# EAGLE design MULTIWII (EAGLE 6.6.0)

## Sheet 1 of 2
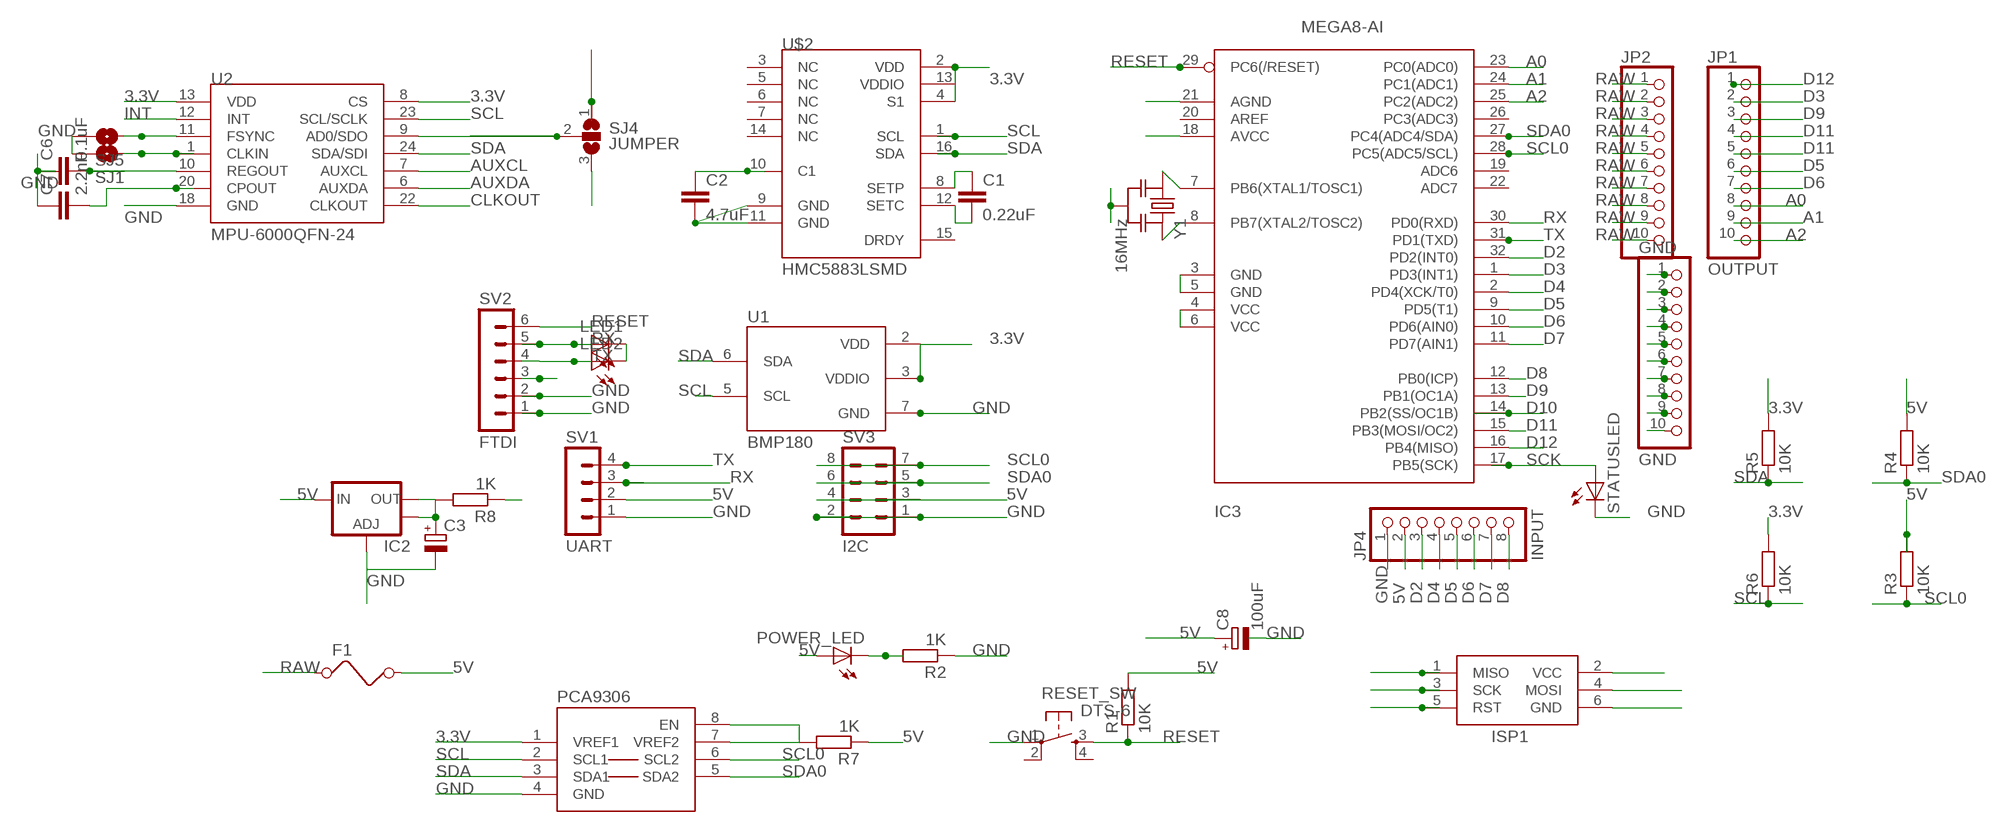
[diagram p0: schematic, sheet 1]

### Parts
C1  0.22uF  C-EUC0805  [C0805]
C2  4.7uF  C-EUC0805  [C0805]
C3  CPOL-EUA/3216-18R  [A/3216-18R]
C6  0.1uF  C-EUC0805  [C0805]
C7  2.2nF  C-EUC0805  [C0805]
C8  100uF  CPOL-EUCT7343  [CT7343]
F1  FUSEF  [1812]
GND  GND  PINHD-1X10  [1X10]
IC2  V_REG_LM1117SOT223  [SOT223]
IC3  MEGA8-AI  [TQFP32-08]
ISP1  AVRISP-6  [AVRISP]
JP1  OUTPUT  PINHD-1X10  [1X10]
JP2  PINHD-1X10  [1X10]
JP4  INPUT  PINHD-1X8  [1X08]
LED1  LEDCHIPLED_0805  [CHIPLED_0805]
LED2  LEDCHIPLED_0805  [CHIPLED_0805]
PCA9306  PCA9306  [PSOP-8]
POWER_LED  LEDCHIPLED_1206  [CHIPLED_1206]
R1  10K  R-EU_M0805  [M0805]
R2  1K  R-EU_M0805  [M0805]
R3  10K  R-EU_M0805  [M0805]
R4  10K  R-EU_M0805  [M0805]
R5  10K  R-EU_M0805  [M0805]
R6  10K  R-EU_M0805  [M0805]
R7  1K  R-EU_M0805  [M0805]
R8  1K  R-EU_M0805  [M0805]
RESET_SW  DTS-6  [DTS-6]
SJ1  SOLDERJUMPERNC  [SJ_2S]
SJ4  JUMPER  SJ2W  [SJ_2]
SJ5  SOLDERJUMPERNC  [SJ_2S]
STATUSLED  LEDCHIP-LED0805  [CHIP-LED0805]
SV1  UART  MA04-1  [MA04-1]
SV2  FTDI  MA06-1  [MA06-1]
SV3  I2C  MA04-2  [MA04-2]
U1  BMP180  [BMP180]
U2  MPU-6000QFN-24  [QFN-24-TESTING]
U$2  HMC5883LSMD  [16LPCC]
Y1  16MHz  RESONATOR-MURATACSTCR_G  [RESONATOR_MURATA3]

### Nets
3.3V: PCA9306.1(VREF1) R5.2 R6.2 R8.1 SJ4.1 U1.2(VDD) U1.3(VDDIO) U2.8(CS) U2.13(VDD) U$2.2(VDD) U$2.4(S1) U$2.13(VDDIO)
5V: C8.+ F1.2 IC2.3(IN) IC3.4(VCC) IC3.6(VCC) IC3.18(AVCC) ISP1.2(VCC) JP4.2 POWER_LED.A R1.2 R3.2 R4.2 R7.1 SV1.2 SV3.3 SV3.4
A0: IC3.23(PC0(ADC0)) JP1.8
A1: IC3.24(PC1(ADC1)) JP1.9
A2: IC3.25(PC2(ADC2)) JP1.10
AD0: SJ4.2 U2.9(AD0/SDO)
AUXCL: U2.7(AUXCL)
AUXDA: U2.6(AUXDA)
C1: C2.1 U$2.10(C1)
CLKOUT: U2.22(CLKOUT)
D2: IC3.32(PD2(INT0)) JP4.3
D3: IC3.1(PD3(INT1)) JP1.2
D4: IC3.2(PD4(XCK/T0)) JP4.4
D5: IC3.9(PD5(T1)) JP1.6 JP4.5
D6: IC3.10(PD6(AIN0)) JP1.7 JP4.6
D7: IC3.11(PD7(AIN1)) JP4.7
D8: IC3.12(PB0(ICP)) JP4.8
D9: IC3.13(PB1(OC1A)) JP1.3
D10: IC3.14(PB2(SS/OC1B)) JP1.4
D11: IC3.15(PB3(MOSI/OC2)) ISP1.4(MOSI) JP1.5
D12: IC3.16(PB4(MISO)) ISP1.1(MISO) JP1.1
GND: C2.2 C3.- C6.1 C7.1 C8.- GND.1 GND.2 GND.3 GND.4 GND.5 GND.6 GND.7 GND.8 GND.9 GND.10 IC2.1(ADJ) IC3.3(GND) IC3.5(GND) IC3.21(AGND) ISP1.6(GND) JP4.1 LED1.C LED2.C PCA9306.4(GND) R2.1 RESET_SW.1 SJ1.2 SJ4.3 SJ5.2 STATUSLED.C SV1.1 SV2.1 SV2.2 SV3.1 SV3.2 U1.7(GND) U2.18(GND) U$2.9(GND) U$2.11(GND) Y1.2
INT: U2.12(INT)
N$1: C7.2 U2.20(CPOUT)
N$2: C3.+ IC2.2(OUT) IC2.4(OUT) R8.2
N$6: IC3.7(PB6(XTAL1/TOSC1)) Y1.1
N$7: C1.1 U$2.8(SETP)
N$8: C1.2 U$2.12(SETC)
N$9: PCA9306.7(VREF2) PCA9306.8(EN) R7.2
N$11: IC3.8(PB7(XTAL2/TOSC2)) Y1.3
N$13: POWER_LED.C R2.2
N$16: SJ5.1 U2.11(FSYNC)
N$17: SJ1.1 U2.1(CLKIN)
N$18: C6.2 U2.10(REGOUT)
RAW: F1.1 JP2.1 JP2.2 JP2.3 JP2.4 JP2.5 JP2.6 JP2.7 JP2.8 JP2.9 JP2.10 SV2.3
RESET: IC3.29(PC6(/RESET)) ISP1.5(RST) R1.1 RESET_SW.3 SV2.6
RX: IC3.30(PD0(RXD)) LED1.A SV1.3 SV2.5
SCK: IC3.17(PB5(SCK)) ISP1.3(SCK) STATUSLED.A
SCL: PCA9306.2(SCL1) R6.1 U1.5(SCL) U2.23(SCL/SCLK) U$2.1(SCL)
SCL0: IC3.28(PC5(ADC5/SCL)) PCA9306.6(SCL2) R3.1 SV3.7 SV3.8
SDA: PCA9306.3(SDA1) R5.1 U1.6(SDA) U2.24(SDA/SDI) U$2.16(SDA)
SDA0: IC3.27(PC4(ADC4/SDA)) PCA9306.5(SDA2) R4.1 SV3.5 SV3.6
TX: IC3.31(PD1(TXD)) LED2.A SV1.4 SV2.4
Unconnected: IC3.19(ADC6) IC3.20(AREF) IC3.22(ADC7) IC3.26(PC3(ADC3)) RESET_SW.2 RESET_SW.4 U$2.3(NC) U$2.5(NC) U$2.6(NC) U$2.7(NC) U$2.14(NC) U$2.15(DRDY)

## Sheet 2 of 2

## Library data of the parts
C1 C2 C6 C7 = rcl:C-EU: CAPACITOR, European symbol
C3 C8 = rcl:CPOL-EU: POLARIZED CAPACITOR, European symbol
F1 = m-pad-2.1:FUSE: Fuse's in various packages
GND JP1 JP2 = pinhead:PINHD-1X10: PIN HEADER
IC2 = SparkFun-PowerIC:V_REG_LM1117: Voltage Regulator LM1117 Standard adjustable voltage regulator but in SMD form. Spark Fun Electronics SKU : COM-00595
IC3 = avr-7:MEGA8: MICROCONTROLLER 8 Kbytes FLASH 1 kbytes SRAM 512 bytes EEPROM USART 6-channel 10 bit ADC 2-channel 8 bit ADC
ISP1 = adafruit:AVRISP: AVR ISP HEADER Standard 6 pin header for AVR programming
JP4 = pinhead:PINHD-1X8: PIN HEADER
LED1 LED2 POWER_LED STATUSLED = adafruit:LED: LED OSRAM: - CHIPLED LG R971, LG N971, LY N971, LG Q971, LY Q971, LO R971, LY R971 LH N974, LH R974 LS Q976, LO Q976, LY Q976 LO Q996 - Hyper CHIPLED LW Q18S LB Q993, LB Q99A, LB R99A - SideLED LS A670, LO A670, LY A670, LG A670, LP A670 LB A673, LV A673, LT A673, LW A673 LH A674 LY A675 LS A676, LA A676, LO A676, LY A676, LW A676 LS A679, LY A679, LG A679 - Hyper Micro SIDELED® LS Y876, LA Y876, LO Y876, LY Y876 LT Y87S - SmartLED LW L88C, LW L88S LB L89C, LB L89S, LG L890 LS L89K, LO L89K, LY L89K LS L896, LA L896, LO L896, LY L896 - TOPLED LS T670, LO T670, LY T670, LG T670, LP T670 LSG T670, LSP T670, LSY T670, LOP T670, LYG T670 LG T671, LOG T671, LSG T671 LB T673, LV T673, LT T673, LW T673 LH T674 LS T676, LA T676, LO T676, LY T676, LB T676, LH T676, LSB T676, LW T676 LB T67C, LV T67C, LT T67C, LS T67K, LO T67K, LY T67K, LW E67C LS E67B, LA E67B, LO E67B, LY E67B, LB E67C, LV E67C, LT E67C LW T67C LS T679, LY T679, LG T679 LS T770, LO T770, LY T770, LG T770, LP T770 LB T773, LV T773, LT T773, LW T773 LH T774 LS E675, LA E675, LY E675, LS T675 LS T776, LA T776, LO T776, LY T776, LB T776 LHGB T686 LT T68C, LB T68C - Hyper Mini TOPLED® LB M676 - Mini TOPLED Santana® LG M470 LS M47K, LO M47K, LY M47K Source: http://www.osram.convergy.de/
PCA9306 = SparkFun-DigitalIC:PCA9306: Bidirectional I2C level shifter. NOT compatible with all available part number pinout schemes- DOUBLE CHECK!!!; PROD_ID: IC-10023
R1-R8 = rcl:R-EU_: RESISTOR, European symbol
RESET_SW = switch-tact:DTS-6
SJ1 SJ5 = Eagle-JeeLabs:SOLDERJUMPER: Solder Jumper Standard SMD solder jumper. Used to automate production. Two varients : Normally Open and Normally Closed are the same, but have different paste layers. NC will have a large amount of paste and should jumper during reflow.
SJ4 = jumper:SJ2W: SMD solder JUMPER
SV1 = con-lstb:MA04-1: PIN HEADER; OC_FARNELL: unknown; OC_NEWARK: unknown
SV2 = con-lstb:MA06-1: PIN HEADER; OC_FARNELL: unknown; OC_NEWARK: unknown
SV3 = con-lstb:MA04-2: PIN HEADER; OC_FARNELL: unknown; OC_NEWARK: unknown
U1 = SparkFun-Sensors:BMP180: BOSCH BMP180 DIGITAL BAROMETRIC PRESSURE SENSOR Web page: http://www.bosch-sensortec.com/en/homepage/products_3/environmental_sensors_1/bmp180_1/bmp180 Datasheet: http://ae-bst.resource.bosch.com/media/products/dokumente/bmp180/BST-BMP180-DS000-09.pdf The BMP180 is the function compatible successor of the BMP085, a new generation of high precision digital pressure sensors for consumer applications. The ultra-low power, low voltage electronics of the BMP180 is optimized for use in mobile phones, PDAs, GPS navigation devices and outdoor equipment. With a low altitude noise of merely 0.25m at fast conversion time, the BMP180 offers superior performance. The I2C interface allows for easy system integration with a microcontroller. The BMP180 is based on piezo-resistive technology for EMC robustness, high accuracy and linearity as well as long term stability. Key features: - Temperature measurement included - I2C interface - Fully calibrated - Pb-free, halogen-free and RoHS compliant, - MSL 1 Basic specs: Pressure range: 300 to 1100hPa (+9000m to -500m relating to sea level) Supply voltage: 1.8 to 3.6V (VDD), 1.62V to 3.6V (VDDIO) Package: LGA package with metal lid Small footprint: 3.6mm x 3.8mm Super-flat: 0.93mm height Low power: 5μA at 1 sample / sec. in standard mode Low noise: 0.06hPa (0.5m) in ultra low power mode, 0.02hPa (0.17m) advanced resolution mode Typical applications: - Enhancement of GPS navigation (dead-reckoning, slope detection, etc.) - In- and out-door navigation - Leisure and sports - Weather forecast - Vertical velocity indication (rise/sink speed)
U2 = SparkFun-Sensors:MPU-6000: MPU-6000 - I2C address is 0x68 with AD0 low and 0x69 with AD0 high.
U$2 = SparkFun-Sensors:HMC5883L: 3 Axis Digital Compass IC
Y1 = m-pad-2.1:RESONATOR-MURATA: Murata ceramic Resonator "ceralock" CSTCE series with built in load capacitance +- 0.5% tolerance 12.51MHz to 19.99MHz 16MHz murata part#: CSTCE16M0V53-R0 16MHz digikey part#: 490-1198-1-ND $1.33 each

## Board
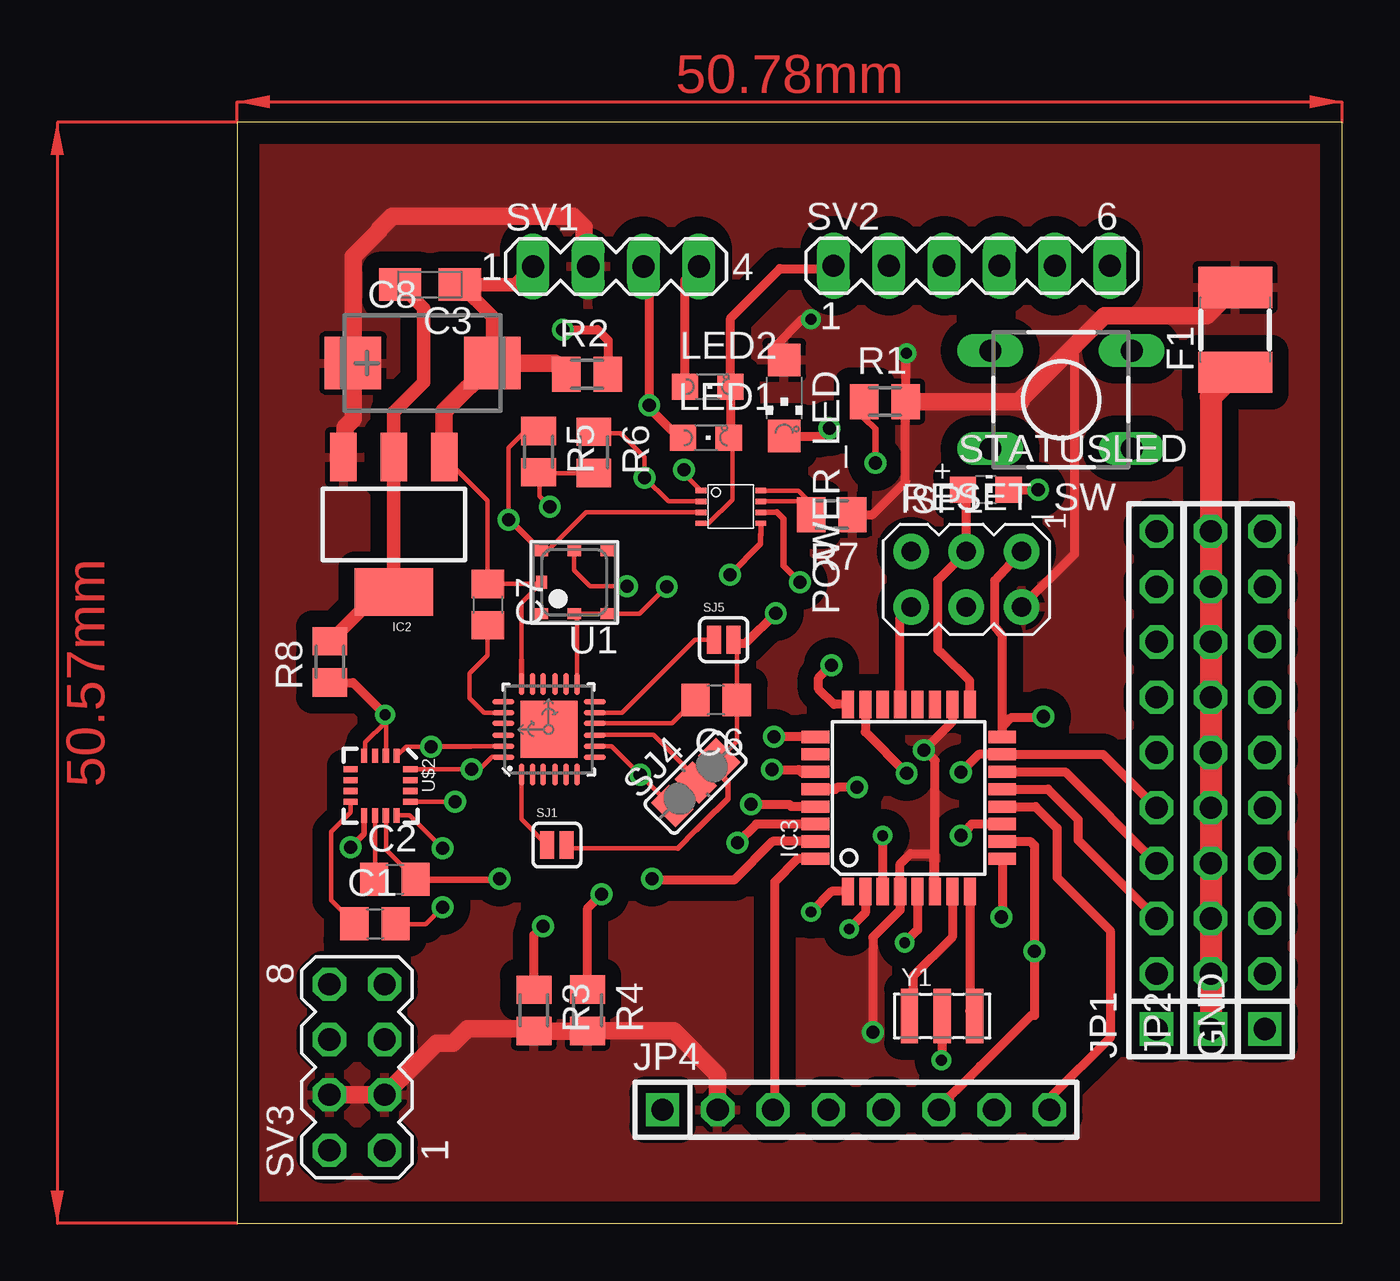
[diagram p1: board, top side]
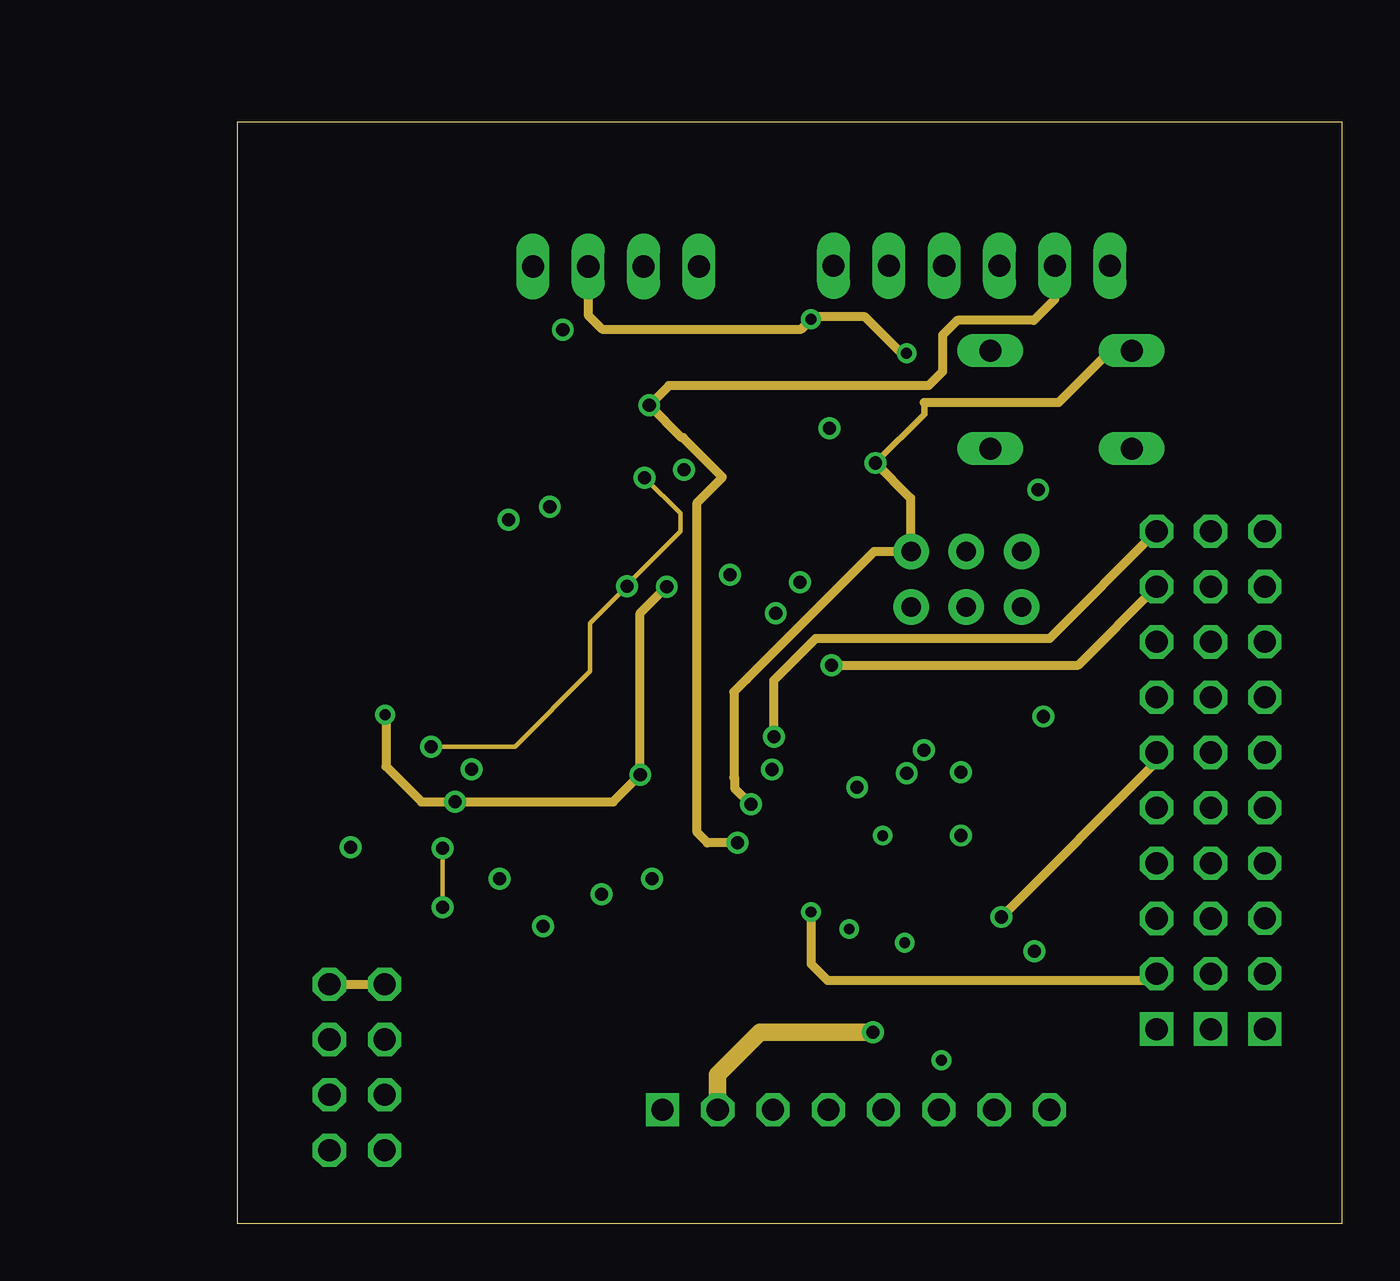
[diagram p2: board, inner layer 2NDLAYER]
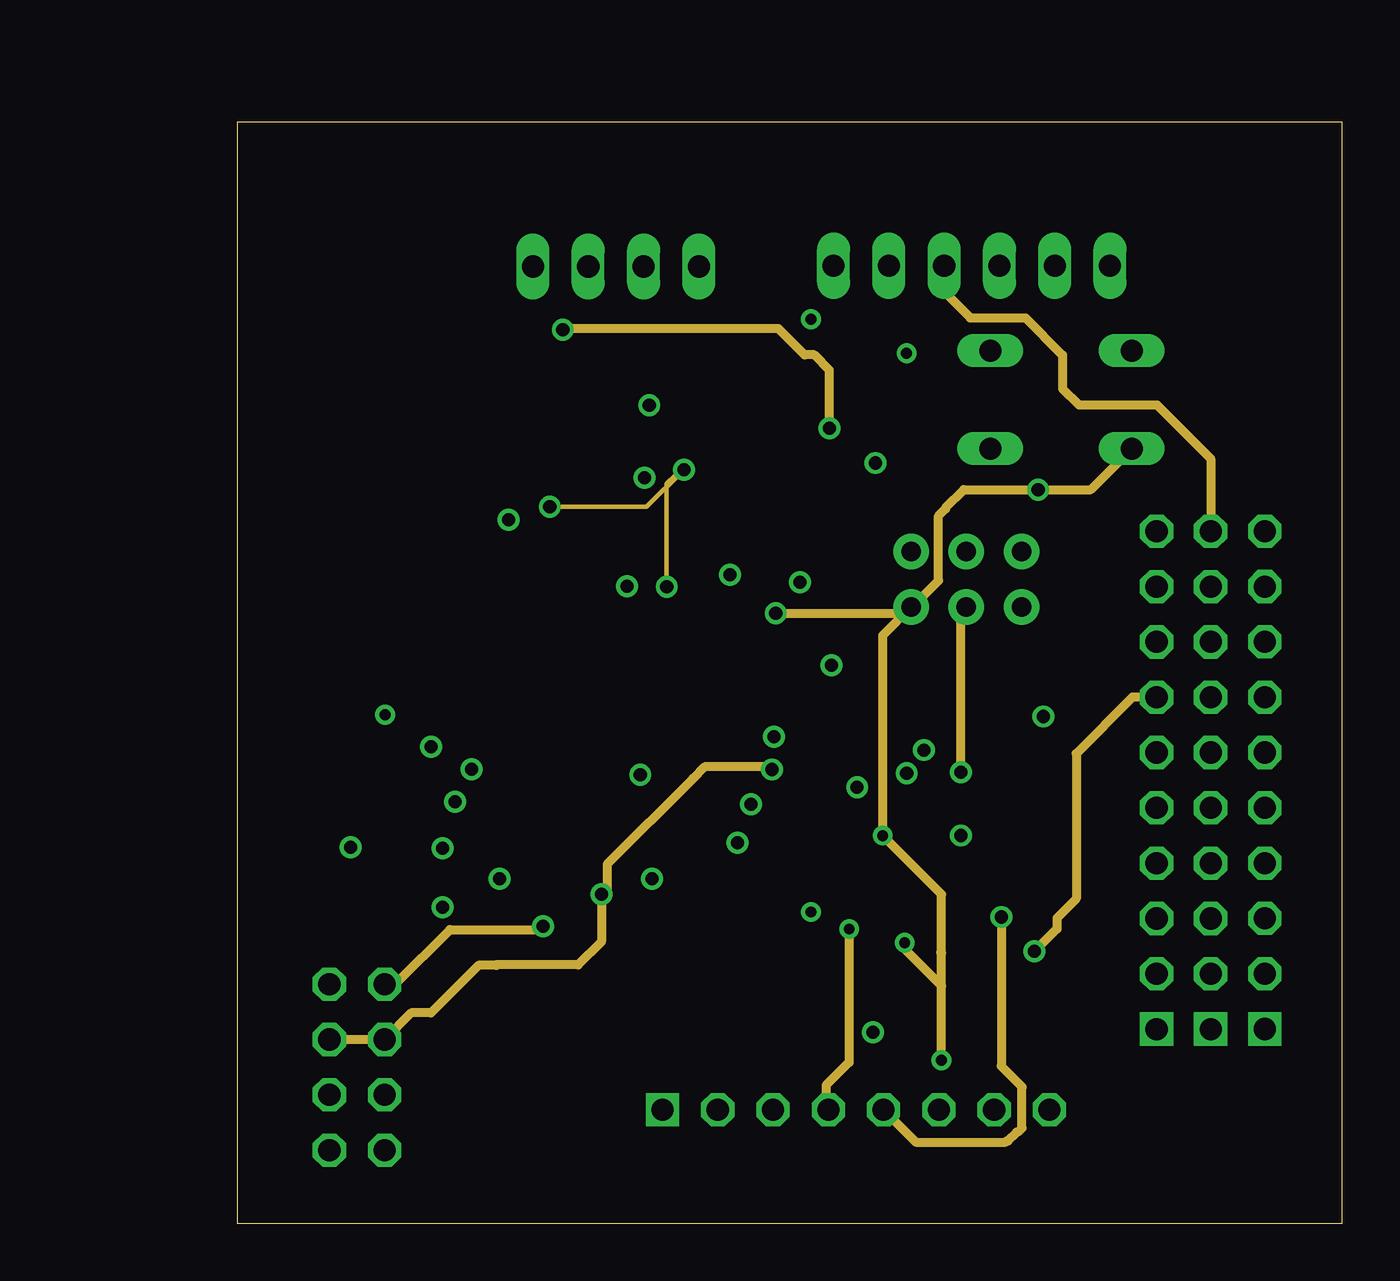
[diagram p3: board, inner layer 3RDLAYER]
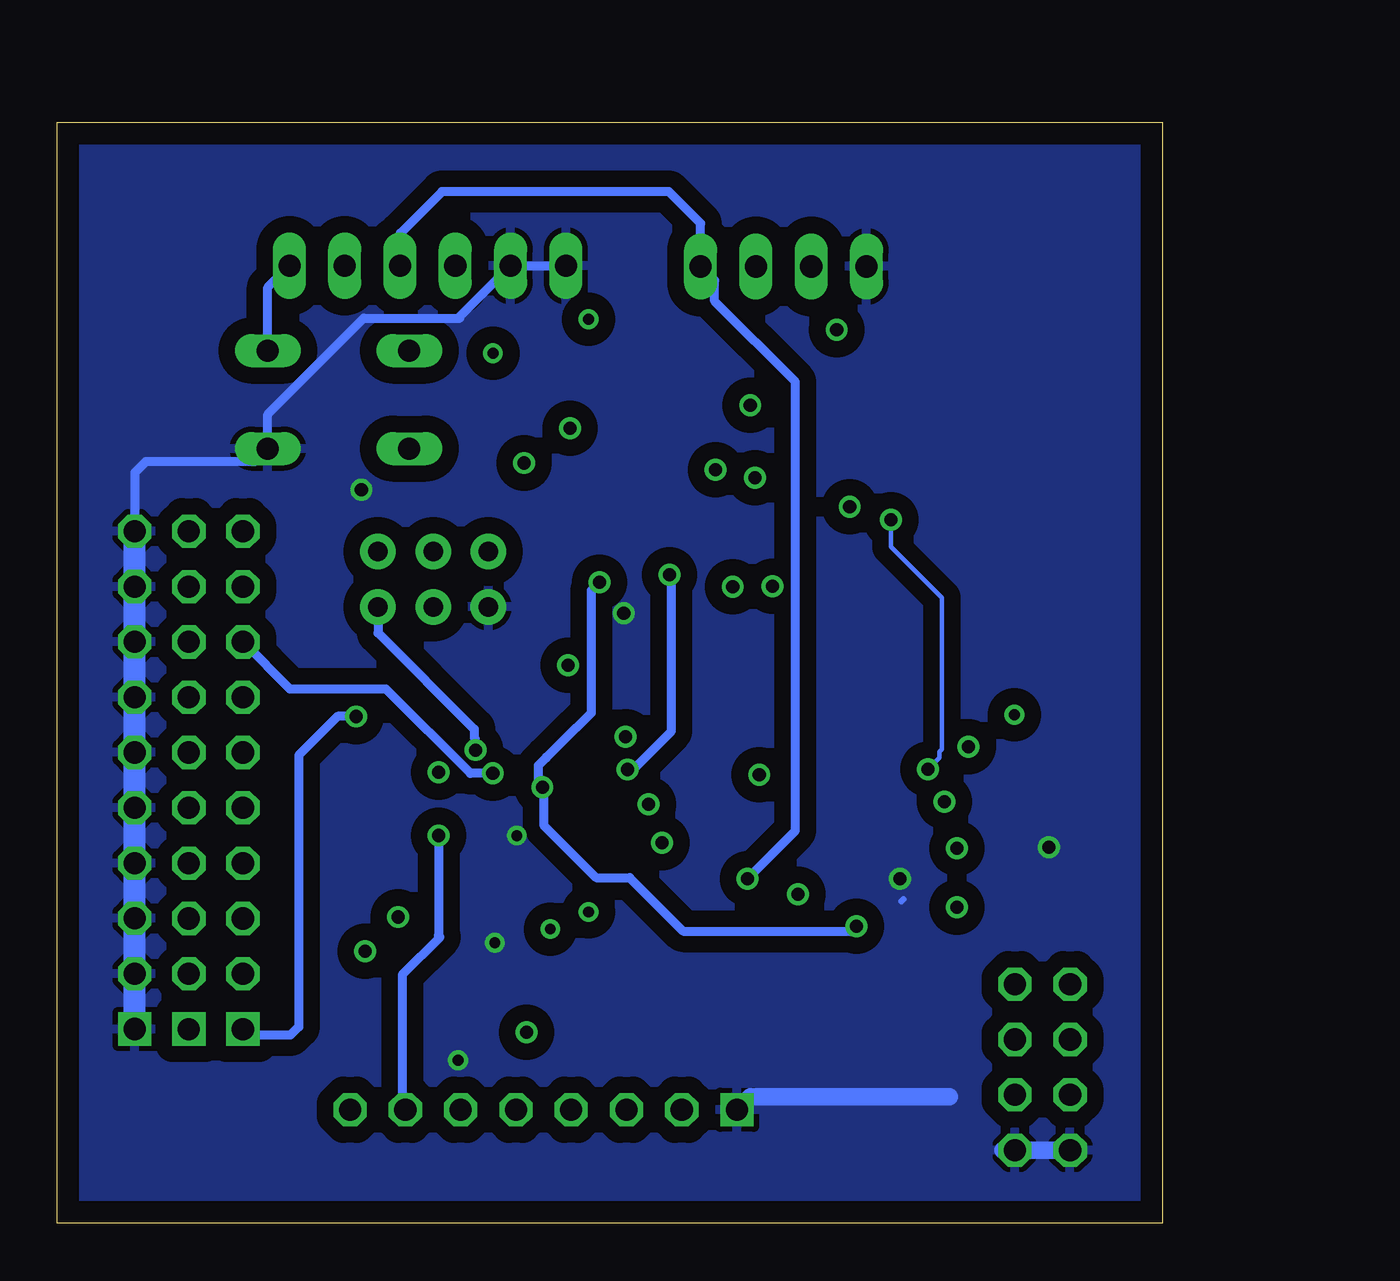
[diagram p4: board, bottom side, seen from below]

Size 50.78 x 50.57 mm. Coordinates in mm from the lower left corner, seen from the top.
Outline: 0,0 50.78,0 50.78,50.57 0,50.57 0,0
Copper layers (1*2+3*16): Top 0.035mm / dielectric 1.5mm / 2NDLAYER 0.035mm / dielectric 0.15mm / 3RDLAYER 0.035mm / dielectric 0.2mm / Bottom 0.035mm
Design rules "default *": minimum track width 8mil, minimum drill 4mil, track to track 30mil, track to pad 30mil, pad to pad 30mil, via to via 30mil, smd to smd 8mil, copper to edge 40mil, drill to drill 8mil, minimum pad ring 10mil, minimum via ring 8mil, stop-mask expansion 4mil, vias tented up to drill 0mil, thermal gap 10mil

### Footprints (pad centres in the part's own frame; a part is rotated, then mirrored left to right if it is on the bottom)
C0805 = smd 1.3 x 1.5: 1 -0.95,0; 2 0.95,0
A/3216-18R = smd 1.95 x 1.5: + 1.375,0; - -1.375,0
CT7343 = smd 2.6 x 2.4: + -3.2,0; - 3.2,0
1812 = smd 1.9 x 3.4: 1 -1.95,0; 2 1.95,0
1X10 = drill 1.016 square: 1 -11.43,0 | drill 1.016 octagon: 2 -8.89,0; 3 -6.35,0; 4 -3.81,0; 5 -1.27,0; 6 1.27,0; 7 3.81,0; 8 6.35,0; 9 8.89,0; 10 11.43,0
SOT223 = smd 1.219 x 2.235: 1 -2.311,-3.099; 2 0,-3.099; 3 2.311,-3.099 | smd 3.6 x 2.2: 4 0,3.099
TQFP32-08 = smd 1.27 x 0.559: 1 -4.293,2.8; 2 -4.293,2; 3 -4.293,1.2; 4 -4.293,0.4; 5 -4.293,-0.4; 6 -4.293,-1.2; 7 -4.293,-2; 8 -4.293,-2.8; 17 4.293,-2.8; 18 4.293,-2; 19 4.293,-1.2; 20 4.293,-0.4; 21 4.293,0.4; 22 4.293,1.2; 23 4.293,2; 24 4.293,2.8 | smd 0.559 x 1.27: 9 -2.8,-4.293; 10 -2,-4.293; 11 -1.2,-4.293; 12 -0.4,-4.293; 13 0.4,-4.293; 14 1.2,-4.293; 15 2,-4.293; 16 2.8,-4.293; 25 2.8,4.293; 26 2,4.293; 27 1.2,4.293; 28 0.4,4.293; 29 -0.4,4.293; 30 -1.2,4.293; 31 -2,4.293; 32 -2.8,4.293
AVRISP = drill 0.9 pad 1.626: 1 -1.27,2.54; 2 1.27,2.54; 3 -1.27,0; 4 1.27,0; 5 -1.27,-2.54; 6 1.27,-2.54
1X08 = drill 1.016 square: 1 -8.89,0 | drill 1.016 octagon: 2 -6.35,0; 3 -3.81,0; 4 -1.27,0; 5 1.27,0; 6 3.81,0; 7 6.35,0; 8 8.89,0
CHIPLED_0805 = smd 1.2 x 1.2: A 0,-1.05; C 0,1.05
PSOP-8 = smd 0.25 x 0.5: 1 -0.73,-1.37; 2 -0.23,-1.37; 3 0.27,-1.37; 4 0.77,-1.37; 5 0.77,1.38; 6 0.27,1.38; 7 -0.23,1.38; 8 -0.73,1.38
CHIPLED_1206 = smd 1.5 x 1.5: A 0,-1.75; C 0,1.75
M0805 = smd 1.3 x 1.6: 1 -0.95,0; 2 0.95,0
DTS-6 = drill 1 long: 1 -3.25,2.25; 2 3.25,2.25; 3 -3.25,-2.25; 4 3.25,-2.25
SJ_2S = smd 0.635 x 1.27: 1 -0.45,0; 2 0.45,0
SJ_2 = smd 1.168 x 1.6: 1 -1.524,0; 2 0,0; 3 1.524,0
CHIP-LED0805 = smd 1.2 x 1.2: A 0,-1.05; C 0,1.05
MA04-1 = drill 1.016 long: 1 -3.81,0; 2 -1.27,0; 3 1.27,0; 4 3.81,0
MA06-1 = drill 1.016 long: 1 -6.35,0; 2 -3.81,0; 3 -1.27,0; 4 1.27,0; 5 3.81,0; 6 6.35,0
MA04-2 = drill 1.016 octagon: 1 -3.81,-1.27; 2 -3.81,1.27; 3 -1.27,-1.27; 4 -1.27,1.27; 5 1.27,-1.27; 6 1.27,1.27; 7 3.81,-1.27; 8 3.81,1.27
BMP180 = smd 0.6 x 0.5: 1 1.5,1.45; 2 0,1.45; 3 -1.5,1.45; 4 -1.5,-1.45; 5 0,-1.45; 6 1.5,-1.45 | smd 0.5 x 0.6: 7 1.5,0
QFN-24-TESTING = smd 1.016 x 0.254: 1 -2.066,1.257; 2 -2.066,0.75; 3 -2.066,0.247; 4 -2.066,-0.287; 5 -2.066,-0.792; 6 -2.066,-1.297; 13 2.086,-1.297; 14 2.086,-0.792; 15 2.086,-0.287; 16 2.086,0.247; 17 2.086,0.75; 18 2.086,1.257 | smd 0.254 x 1.016: 7 -1.267,-2.122; 8 -0.762,-2.122; 9 -0.258,-2.122; 10 0.278,-2.122; 11 0.78,-2.122; 12 1.287,-2.122; 19 1.287,2.082; 20 0.78,2.082; 21 0.278,2.082; 22 -0.258,2.082; 23 -0.762,2.082; 24 -1.267,2.082 | smd 2.616 x 2.616: P$1 0.02,-0.01
16LPCC = smd 0.65 x 0.28: 1 -1.37,0.75; 2 -1.37,0.25; 3 -1.37,-0.25; 4 -1.37,-0.75; 9 1.37,-0.75; 10 1.37,-0.25; 11 1.37,0.25; 12 1.37,0.75 | smd 0.28 x 0.65: 5 -0.75,-1.37; 6 -0.25,-1.37; 7 0.25,-1.37; 8 0.75,-1.37; 13 0.75,1.37; 14 0.25,1.37; 15 -0.25,1.37; 16 -0.75,1.37
RESONATOR_MURATA3 = smd 0.8 x 2.5: 1 -1.5,0; 2 0,0; 3 1.5,0

### Placement (x,y rotation side)
C1  6.34,13.77 0 top
C2  7.25,15.8 0 top
C3  8.87,43.12 180 top
C6  22.02,24.03 180 top
C7  11.53,28.42 270 top
C8  8.53,39.51 0 top
F1  45.86,41.04 90 top
GND  47.22,20.36 90 top
IC2  7.21,32.1 180 top
IC3  30.87,19.54 90 top
ISP1  33.51,29.58 270 top
JP1  42.25,20.36 90 top
JP2  44.73,20.36 90 top
JP4  28.44,5.22 0 top
LED1  21.55,36.09 270 top
LED2  21.63,38.43 270 top
PCA9306  22.68,32.93 270 top
POWER_LED  25.14,37.91 180 top
R1  29.77,37.74 0 top
R2  16.08,39 0 top
R3  13.65,9.79 270 top
R4  16.11,9.79 270 top
R5  13.86,35.45 270 top
R6  16.39,35.41 270 top
R7  27.33,32.55 180 top
R8  4.27,25.79 90 top
RESET_SW  37.86,37.83 180 top
SJ1  14.7,17.37 0 top
SJ4  21.08,20.25 45 top
SJ5  22.36,26.81 0 top
STATUSLED  34.4,33.7 270 top
SV1  17.41,43.95 0 top
SV2  33.76,43.98 0 top
SV3  5.52,7.18 90 top
U1  15.5,29.44 180 top
U2  14.32,22.68 90 top
U$2  6.59,20.11 270 top
Y1  32.4,9.53 0 top

### Tracks (layer width: path | path; a pad name or v marks a point on that pad's centre or on a via)
3.3V  (via drill 0.5, 0.6)
  Top 0.203: U$2.2 6.84,23.32 v6.81,23.36 | v6.81,23.36 6.81,23.01 5.89,22.09 5.89,21.53 U$2.4 | v6.81,23.36 6.81,23.27 6.84,23.23 | U2.13 15.62,27.87 U1.2 U1.3 18.49,27.99 v19.75,29.25 | 20.32,19.18 SJ4.1 19.97,19.17 v18.53,20.61 17.21,21.92 U2.8 | U$2.13 v10.02,19.36 v10.03,19.36 | v20.53,34.62 20.53,34.43 PCA9306.1 | 13.89,34.46 13.89,33.39 v14.37,32.91 | R6.2 13.89,34.46 | 13.89,34.46 R5.2
  Top 0.406: R8.1 5.33,24.84 v6.81,23.36
  2NDLAYER 0.203: 6.87,23.29 6.84,23.32 v6.81,23.36 | v10.03,19.36 10.05,19.36
  2NDLAYER 0.406: 6.84,23.32 6.84,20.99 8.48,19.36 10.05,19.36 17.28,19.36 v18.53,20.61 18.53,28.03 v19.75,29.25
  3RDLAYER 0.203: v19.75,29.25 19.75,33.98 20.14,34.37 20.29,34.37 v20.53,34.62 18.82,32.91 v14.37,32.91
5V  (via drill 0.5, 0.6)
  Top 0.406: 29.28,8.71 v29.22,8.78 29.22,13.13 30.47,14.39 IC3.4 30.47,16.5 30.95,16.98 31.94,16.98 32,16.93 32,15.32 IC3.6 32.07,21.27 31.73,21.61 31.7,21.61 v31.57,21.74 32.87,23.04 IC3.18 | R1.2 30.72,39.92 v30.76,39.96 | v26.37,41.52 25.97,41.52 24.7,40.25 24.7,40.1 POWER_LED.A | ISP1.2 38.49,30.75 38.49,39.87 38.26,40.09 | R7.1 29.2,32.55 30.71,34.07 30.71,37.16 31.3,37.74
  Top 0.813: IC2.3 4.96,35.26 4.96,36.55 5.33,36.93 C8.+ 5.33,44.4 6.52,45.59 6.52,45.65 7.14,46.26 15.44,46.26 15.94,45.76 15.94,44.14 SV1.2 | JP4.2 22.09,6.83 20.08,8.84 R4.2 16.1,8.84 R3.2 13.54,8.94 10.59,8.94 9.94,8.28 9.16,8.28 SV3.3 SV3.4 | R1.2 31.3,37.74 36.03,37.74 36.03,37.86 38.26,40.09 39.86,41.69 44.56,41.69 F1.2
  2NDLAYER 0.406: v30.76,39.96 30.53,39.96 28.86,41.64 26.49,41.64 v26.37,41.52 25.92,41.07 16.78,41.07 16.14,41.71 SV1.2
  2NDLAYER 0.813: v29.22,8.78 24.03,8.78 22.09,6.83 JP4.2
  Bottom 0.406: ISP1.2 36.05,27.13 31.63,22.7 31.63,22.32 31.57,22.26 v31.57,21.74
  pour Top: 50.12,50.09 50.12,0.49 0.52,0.49 0.52,49.99
A0  (via drill 0.6)
  Top 0.406: IC3.23 28.87,22.57 v30.77,20.67
  Bottom 0.406: v30.77,20.67 31.8,20.67 35.67,24.54 40.08,24.54 JP1.8
A1  (via drill 0.6)
  Top 0.406: IC3.24 27.43,23.83 26.72,24.54 26.72,25.06 v27.31,25.64
  2NDLAYER 0.406: v27.31,25.64 38.65,25.64 JP1.9
A2  (via drill 0.6)
  Top 0.406: IC3.25 24.68,22.34 v24.66,22.36
  2NDLAYER 0.406: v24.66,22.36 24.66,24.94 | JP1.10 37.34,26.87 26.6,26.87 24.66,24.94 | 24.66,24.94
AD0
  Top 0.203: U2.9 16.46,22.44 19.13,22.44 21.07,20.49 SJ4.2
C1
  Top 0.203: U$2.10 6.34,16.4 C2.1
D2
  Top 0.406: IC3.32 25.76,16.74 24.7,15.68 24.7,5.28 JP4.3
D3  (via drill 0.5)
  Top 0.406: IC3.1 27.32,15.25 v26.37,14.3
  2NDLAYER 0.406: JP1.2 41.94,11.16 27.14,11.16 26.37,11.92 v26.37,14.3
D4  (via drill 0.5)
  Top 0.406: IC3.2 28.87,14.26 v28.13,13.52
  3RDLAYER 0.406: v28.13,13.52 28.13,7.4 27.07,6.34 27.07,5.32 JP4.4
D5  (via drill 0.6)
  Top 0.406: IC3.9 35.16,14.11 v35.12,14.07
  2NDLAYER 0.406: JP1.6 42.25,21.2 v35.12,14.07
  3RDLAYER 0.406: v35.12,14.07 35.12,7.23 36.08,6.26 36.06,6.24 36.06,4.38 35.88,4.19 35.82,4.19 35.42,3.79 35.36,3.79 35.31,3.74 31.19,3.74 JP4.5
D6  (via drill 0.6)
  Top 0.406: IC3.10 36.45,17.54 36.64,17.35 v36.64,12.5 36.64,9.55 36.48,9.55 35.3,8.37 | 35.3,8.37 34.16,7.22 34.15,7.22 33.06,6.13 33.03,6.13 32.72,5.82 32.72,5.69 JP4.6 | 35.3,8.37
  3RDLAYER 0.406: JP1.7 41.15,24.17 38.56,21.57 38.56,14.91 37.67,14.03 37.67,13.53 v36.64,12.5
D7  (via drill 0.6)
  Top 0.406: IC3.11 33.76,18.34 33.61,18.19 33.61,18.17 v33.26,17.82
  Bottom 0.406: JP4.7 34.93,5.36 34.93,11.42 33.19,13.15 33.26,13.22 v33.26,17.82
D8
  Top 0.406: IC3.12 36.69,19.14 37.67,18.16 37.67,15.89 40.11,13.45 40.11,8.53 37.4,5.82 37.4,5.29 JP4.8 37.67,5.56
D9
  Top 0.406: IC3.13 37.26,19.94 38.64,18.56 38.64,17.61 JP1.3
D10
  Top 0.406: IC3.14 38.05,20.74 JP1.4
D11  (via drill 0.6)
  Top 0.406: JP1.5 39.79,21.54 IC3.15 34.08,21.54 v33.26,20.72
  3RDLAYER 0.406: v33.26,20.72 33.26,28.06 ISP1.4
D12  (via drill 0.6)
  Top 0.406: v37.06,23.28 37.02,23.24 35.58,23.24 35.16,22.82 IC3.16 35.16,26.99 34.81,27.43 34.81,29.53 ISP1.1
  Bottom 0.406: v37.06,23.28 37.91,23.28 39.69,21.5 39.69,9.03 40.08,8.64 41.97,8.64 JP1.1
GND  (via drill 0.5, 0.6)
  Top 0.203: U2.18 13.06,28.51 U1.7 13.92,29.37 C7.1 11.52,33.19 IC2.1 | SJ4.3 22.97,22.14 C6.1 22.97,26.65 SJ5.2 | C2.2 6.84,17.16 U$2.11 | 20.25,17.22 15.09,17.22 15.09,17.31 SJ1.2 | PCA9306.4 21.67,32.16 22.77,33.25 22.77,35.92 LED1.C
  Top 0.254: 8.22,15.79 C2.2 | U$2.9 5.84,17.89 v5.23,17.27 | U2.18 13.06,25.87 | SJ4.3 22.15,20.67 22.55,20.27 22.55,19.5 22,18.94 21.98,18.94 21.11,18.07 21.1,18.07 20.25,17.22
  Top 0.305: 8.22,15.79 12.02,15.79 v12.06,15.83
  Top 0.406: IC3.3 v29.67,17.81 | Y1.2 32.4,7.52 v32.37,7.49 | IC3.5 31.27,13.48 v30.68,12.89 | LED1.C 22.68,36.17 LED2.C 22.68,41.58 24.95,43.85 27.27,43.85 SV2.1 | 22.97,26.65 23.37,26.65 v24.75,28.03 | IC3.21 30.47,27.81 ISP1.6 | 13.11,43.46 SV1.1 | STATUSLED.C v36.8,33.7 v36.81,33.7
  Top 0.61: SV1.1 12.77,43.12 C3.- 11.73,41.63 C8.-
  Top 0.813: IC2.1 9.52,37.3 C8.- 14.62,39.51 R2.1
  3RDLAYER 0.406: ISP1.6 29.67,27.01 v29.67,17.81 32.37,15.11 32.37,12.41 | v32.37,7.49 32.37,10.91 | 32.37,10.91 32.37,12.41 | 32.33,12.44 32.37,12.41 | v30.68,12.89 30.68,12.6 32.37,10.91 | ISP1.6 31.02,28.31 32.23,29.52 32.23,32.5 32.55,32.82 32.55,32.86 33.4,33.7 v36.81,33.7 39.23,33.7 RESET_SW.1 | v24.75,28.03 30.69,28.03 ISP1.6
  Bottom 0.254: 9.72,5.74 9.8,5.82
  Bottom 0.305: 11.9,14.89 11.99,14.79
  Bottom 0.406: GND.10 47.22,34.48 46.71,34.98 41.71,34.98 RESET_SW.1 41.11,37.16 36.7,41.57 32.28,41.57 32.28,41.65 SV2.2 SV2.1
  Bottom 0.813: SV3.2 SV3.1 7.35,3.37 | 9.8,5.82 18.94,5.82 JP4.1
  Bottom 1.016: GND.1 GND.2 GND.3 GND.4 GND.5 GND.6 GND.7 GND.8 GND.9 GND.10
  pour Bottom: 50.23,50.09 50.23,0.49 0.43,0.49 0.43,49.85
N$1
  Top 0.203: C7.2 11.52,26.1 10.69,25.27 10.69,24.12 11.35,23.46 U2.20
N$2
  Top 0.61: R8.2 6.53,29 IC2.4 IC2.2 7.21,37.26 8.58,38.63 8.58,42.03 C3.+
N$6
  Top 0.406: IC3.7 32.87,13.15 31.07,11.35 31.07,10.34 30.87,10.15 30.87,9.55 Y1.1
N$7
  Top 0.203: U$2.8 5.22,18.89 4.32,17.98 4.32,14.84 C1.1
N$8  (via drill 0.6)
  Top 0.203: U$2.12 7.94,18.74 v9.45,17.23 | v9.45,14.51 8.67,13.74 7.32,13.74 C1.2
  2NDLAYER 0.203: v9.45,17.23 v9.45,14.51
N$9
  Top 0.203: PCA9306.7 25.77,33.16 R7.2 26.33,32.6 26.33,33.13 25.81,33.66 PCA9306.8
N$11
  Top 0.406: IC3.8 33.67,9.75 Y1.3
N$13  (via drill 0.6)
  Top 0.406: POWER_LED.C 26.85,36.16 v27.22,36.53 | v14.97,41.05 16.56,41.05 17.05,40.56 17.05,39.02 R2.2
  3RDLAYER 0.406: v27.22,36.53 27.22,39.19 26.52,39.88 26.08,39.88 24.87,41.09 15.02,41.09 v14.97,41.05
N$16
  Top 0.203: U2.11 16.46,23.44 17.68,23.44 21.05,26.81 SJ5.1
N$17
  Top 0.203: U2.1 13.06,18.56 SJ1.1
N$18
  Top 0.203: U2.10 19.99,22.96 C6.2
RAW
  Top 0.406: F1.1
  Top 1.016: F1.1 44.73,37.96 JP2.10 JP2.9 JP2.8 JP2.7 JP2.6 JP2.5 JP2.4 JP2.3 JP2.2 JP2.1
  3RDLAYER 0.406: SV2.3 32.49,42.79 33.69,41.59 36.22,41.59 37.93,39.88 37.93,38.34 38.68,37.59 42.27,37.59 44.73,35.13 JP2.10
RESET  (via drill 0.6)
  Top 0.203: 26.67,19.18 IC3.29
  Top 0.305: v29.33,34.92 29.33,36.49 28.86,36.96 28.86,37.71 R1.1
  Top 0.406: v23.61,19.24 25.38,19.24 25.47,19.15 26.57,19.15 IC3.29
  2NDLAYER 0.305: 31.58,37.7 31.58,37.17 v29.33,34.92
  2NDLAYER 0.406: 31.58,37.7 37.76,37.7 40.13,40.08 RESET_SW.3 | v23.61,19.24 22.86,19.99 22.86,20.45 22.82,20.49 22.82,24.41 23.4,24.99 23.41,24.99 29.27,30.85 ISP1.5 30.95,30.87 30.95,33.31 v29.33,34.92
  Bottom 0.406: RESET_SW.3 41.11,42.99 SV2.6
RX  (via drill 0.6)
  Top 0.406: LED1.A 20.3,36.09 18.94,37.44 v18.94,37.57 18.94,43.69 SV1.3 | IC3.30 23.86,18.34 v22.99,17.48
  2NDLAYER 0.406: v22.99,17.48 21.61,17.48 21.14,17.96 21.14,33.11 22.31,34.28 LED1.A 20.43,36.09 v18.94,37.57 19.84,38.47 31.77,38.47 32.41,39.12 32.41,40.79 33.09,41.47 36.61,41.47 37.57,42.44 SV2.5
SCK
  Top 0.406: IC3.17 33.67,24.91 32.36,26.22 32.33,26.22 32.2,26.35 32.2,29.54 ISP1.3 33.51,33.54 STATUSLED.A
SCL  (via drill 0.6)
  Top 0.203: 16.45,36.42 R6.1 16.46,36.29 17.62,36.29 18.73,35.18 v18.73,34.24 19.82,33.16 PCA9306.2 | U$2.1 7.76,21.89 10.75,21.89 10.78,21.92 U2.23 8.94,21.92 v8.91,21.9 | U1.5 15.5,29.99 16.22,29.27 v17.91,29.27
  2NDLAYER 0.203: v18.73,34.24 20.37,32.6 20.37,31.78 17.91,29.33 v17.91,29.27 16.22,27.57 16.22,25.35 12.77,21.9 v8.91,21.9
SCL0  (via drill 0.6)
  Top 0.203: 13.97,10.29 R3.1 | 26.66,20.03 IC3.28
  Top 0.254: PCA9306.6 24.81,32.66
  Top 0.305: 24.81,32.66 25.11,32.35 25.11,30.19 v25.86,29.44
  Top 0.406: R3.1 13.65,13.24 v14.06,13.65 13.77,13.36 | v28.49,20.03 27.57,20.03 27.48,19.93 IC3.28
  2NDLAYER 0.406: SV3.8 SV3.7
  3RDLAYER 0.406: SV3.7 7.27,10.99 9.78,13.5 13.9,13.5 v14.06,13.65
  Bottom 0.203: 28.67,20.2 v28.49,20.03 28.43,19.97 | 28.32,21.43
  Bottom 0.406: 28.67,20.2 28.67,21.04 28.32,21.39 | 28.32,21.39 26.92,22.78 26.9,22.78 26.52,23.16 | 26.52,23.16 | 26.52,23.16 26.24,23.44 26.24,29.07 v25.86,29.44 | 28.32,21.43 28.32,21.39 | 28.43,19.97 28.43,18.3 26.02,15.88 24.48,15.88 22.02,13.42 14.29,13.42 v14.06,13.65
SDA  (via drill 0.6)
  Top 0.203: R5.1 13.25,36.4 12.49,35.63 12.49,32.4 U1.6 | U$2.16 v10.78,20.86 11.15,20.86 11.72,21.43 12.23,21.43 U2.24 | U1.6 14.28,30.89 16.04,32.66 PCA9306.3 | U1.6 13.9,30.89 v12.48,32.31
  Bottom 0.203: v12.48,32.31 12.48,31.08 10.14,28.74 10.14,21.78 10.26,21.66 10.26,21.38 v10.78,20.86
SDA0  (via drill 0.6)
  Top 0.203: 26.47,20.85 IC3.27
  Top 0.254: PCA9306.5 24.06,31.62 24.06,31.21 v22.65,29.8
  Top 0.406: 26.63,20.69 IC3.27 26.54,20.71 25.94,20.71 25.81,20.85 v24.58,20.85 | R4.1 16.11,14.48 v16.75,15.11
  3RDLAYER 0.203: 24.46,20.96 v24.58,20.85
  3RDLAYER 0.406: 24.46,20.96 21.49,20.96 20.95,20.43 | 20.95,20.43 | 20.95,20.43 17.01,16.49 17.01,15.38 v16.75,15.11 16.75,12.94 15.68,11.87 11.89,11.87 11.91,11.85 11.09,11.85 8.91,9.67 8.01,9.67 SV3.5 SV3.6
  Bottom 0.406: v24.58,20.85 24.33,20.85 22.57,22.61 22.57,29.71 v22.65,29.8
TX  (via drill 0.6)
  Top 0.406: LED2.A 20.58,43.31 SV1.4 | IC3.31 24.61,17.54 22.83,15.77 19.13,15.77 v19.07,15.83
  Bottom 0.406: SV2.4 35.01,44.01 35.01,45.48 33.1,47.39 22.68,47.39 21.22,45.93 SV1.4 20.58,43.31 20.58,42.36 16.87,38.65 16.87,18.03 v19.07,15.83
(copper drawn outside any net)
  shapes: Top area x2

### Text on the board
_tsilk: A2 | A1 | A0 | D6 | D5 | D11 | D10 | D9 | D3 | D12 | 5V | D2 | GND | D4 | D5 | D6 | D7 | D8